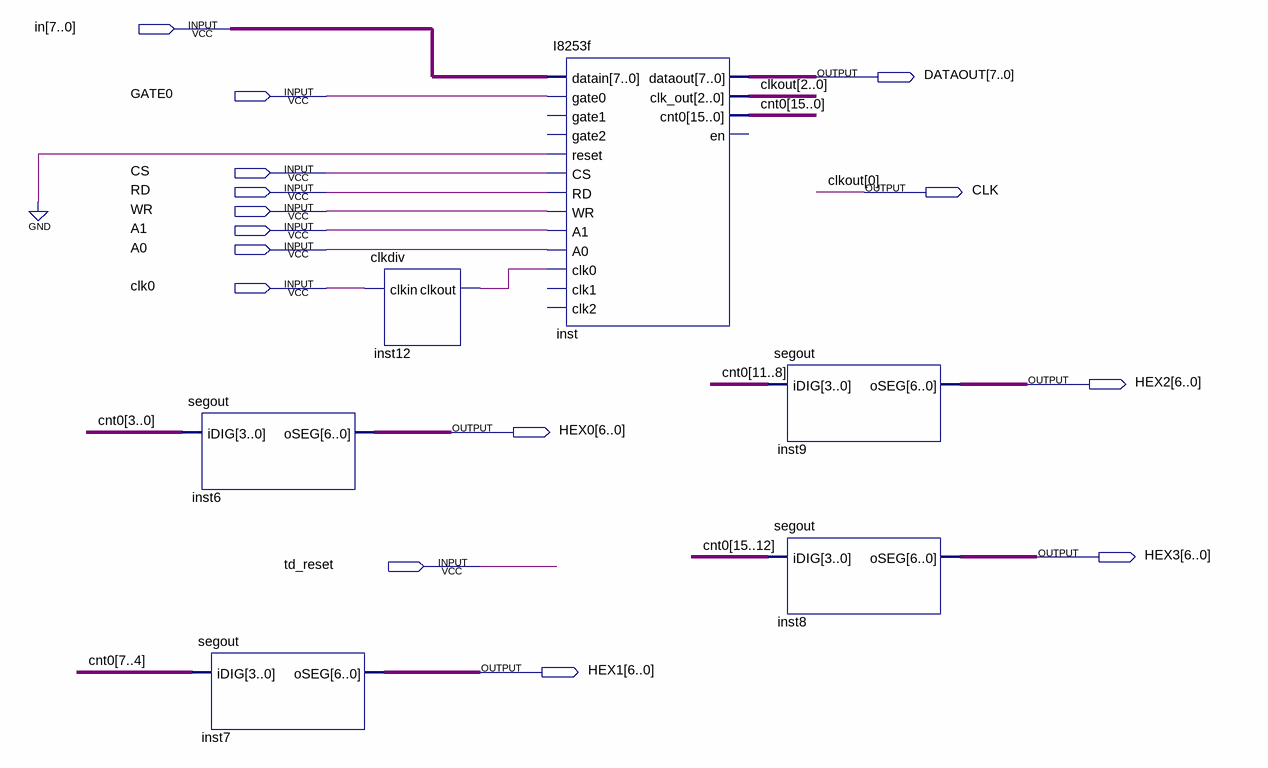
[diagram p0: schematic sheet]
// Quartus schematic 8253_down.bdf as structural Verilog: 6 symbols, 15 pins
module \8253_down  (
  input  [7:0] in,
  input  GATE0,
  input  CS,
  input  RD,
  input  WR,
  input  A1,
  input  A0,
  input  clk0,
  input  td_reset,
  output [7:0] DATAOUT,
  output CLK,
  output [6:0] HEX2,
  output [6:0] HEX0,
  output [6:0] HEX3,
  output [6:0] HEX1
);

  wire inst12_clkout;
  wire [2:1] clkout;
  wire [15:0] cnt0;

  segout inst6 (.iDIG(cnt0[3:0]), .oSEG(HEX0));
  segout inst7 (.iDIG(cnt0[7:4]), .oSEG(HEX1));
  clkdiv inst12 (.clkin(clk0), .clkout(inst12_clkout));
  I8253f inst (
    .datain(in), .gate0(GATE0), .reset(1'b0), .CS(CS), .RD(RD), .WR(WR), .A1(A1), .A0(A0),
    .clk0(inst12_clkout), .dataout(DATAOUT), .clk_out({clkout, CLK}), .cnt0(cnt0));  // open: gate1, gate2, clk1, clk2, en
  segout inst9 (.iDIG(cnt0[11:8]), .oSEG(HEX2));
  segout inst8 (.iDIG(cnt0[15:12]), .oSEG(HEX3));

  // Other names for the same wires on the sheet: clkout[0] = CLK
endmodule
